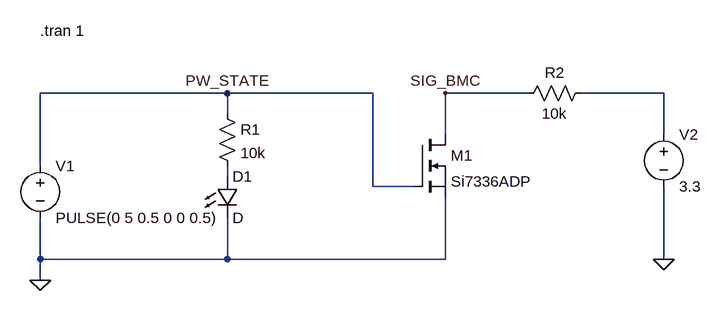
[diagram p0: schematic bmc_pw_state_sim.asc]
bmc_pw_state_sim.asc, the LTspice schematic file:
Version 4
SHEET 1 1040 680
WIRE 288 32 0 32
WIRE 512 32 288 32
WIRE 752 32 624 32
WIRE 960 32 832 32
WIRE 288 64 288 32
WIRE 624 96 624 32
WIRE 960 96 960 32
WIRE 0 144 0 32
WIRE 288 160 288 144
WIRE 512 176 512 32
WIRE 576 176 512 176
WIRE 0 288 0 224
WIRE 288 288 288 224
WIRE 288 288 0 288
WIRE 624 288 624 192
WIRE 624 288 288 288
WIRE 960 288 960 176
WIRE 0 320 0 288
FLAG 0 320 0
FLAG 960 288 0
FLAG 288 32 PW_STATE
FLAG 624 32 SIG_BMC
SYMBOL voltage 0 128 R0
WINDOW 123 0 0 Left 0
WINDOW 39 0 0 Left 0
SYMATTR InstName V1
SYMATTR Value PULSE(0 5 0.5 0 0 0.5)
SYMBOL res 272 48 R0
SYMATTR InstName R1
SYMATTR Value 10k
SYMBOL LED 272 160 R0
SYMATTR InstName D1
SYMBOL voltage 960 80 R0
WINDOW 123 0 0 Left 0
WINDOW 39 0 0 Left 0
SYMATTR InstName V2
SYMATTR Value 3.3
SYMBOL res 848 16 R90
WINDOW 0 0 56 VBottom 2
WINDOW 3 32 56 VTop 2
SYMATTR InstName R2
SYMATTR Value 10k
SYMBOL nmos 576 96 R0
SYMATTR InstName M1
SYMATTR Value Si7336ADP
TEXT 0 -64 Left 2 !.tran 1

The netlist it stands for:
* bmc_pw_state_sim.asc
V1 PW_STATE 0 PULSE(0 5 0.5 0 0 0.5)
R1 PW_STATE N002 10k
D1 N002 0 D
V2 N001 0 3.3
R2 N001 SIG_BMC 10k
M1 SIG_BMC PW_STATE 0 0 Si7336ADP
.model D D
.lib standard.dio
.model NMOS NMOS
.model PMOS PMOS
.lib standard.mos
.tran 1
.backanno
.end